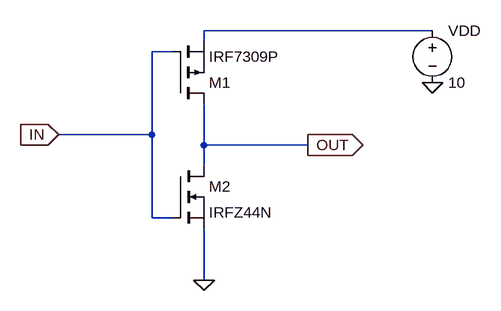
[diagram p0: schematic Draft2.asc]
Draft2.asc, the LTspice schematic file:
Version 4
SHEET 1 960 680
WIRE 608 -144 256 -144
WIRE 256 -128 256 -144
WIRE 208 -112 176 -112
WIRE 176 16 176 -112
WIRE 176 16 32 16
WIRE 256 32 256 -32
WIRE 416 32 256 32
WIRE 256 64 256 32
WIRE 176 144 176 16
WIRE 208 144 176 144
WIRE 256 240 256 160
FLAG 256 240 0
FLAG 608 -64 0
FLAG 32 16 IN
IOPIN 32 16 In
FLAG 416 32 OUT
IOPIN 416 32 Out
SYMBOL voltage 608 -160 R0
WINDOW 123 0 0 Left 0
WINDOW 39 0 0 Left 0
SYMATTR InstName VDD
SYMATTR Value 10
SYMBOL pmos 208 -32 M180
SYMATTR InstName M1
SYMATTR Value IRF7309P
SYMBOL nmos 208 64 R0
SYMATTR InstName M2
SYMATTR Value IRFZ44N

The netlist it stands for:
* Draft2.asc
VDD N001 0 10
M1 OUT IN N001 N001 IRF7309P
M2 OUT IN 0 0 IRFZ44N
.model NMOS NMOS
.model PMOS PMOS
.lib standard.mos
.backanno
.end